# Altium schematic sheet top_ebox_v3.SchDoc
size A; SheetNumber: 1; SheetTotal: 2
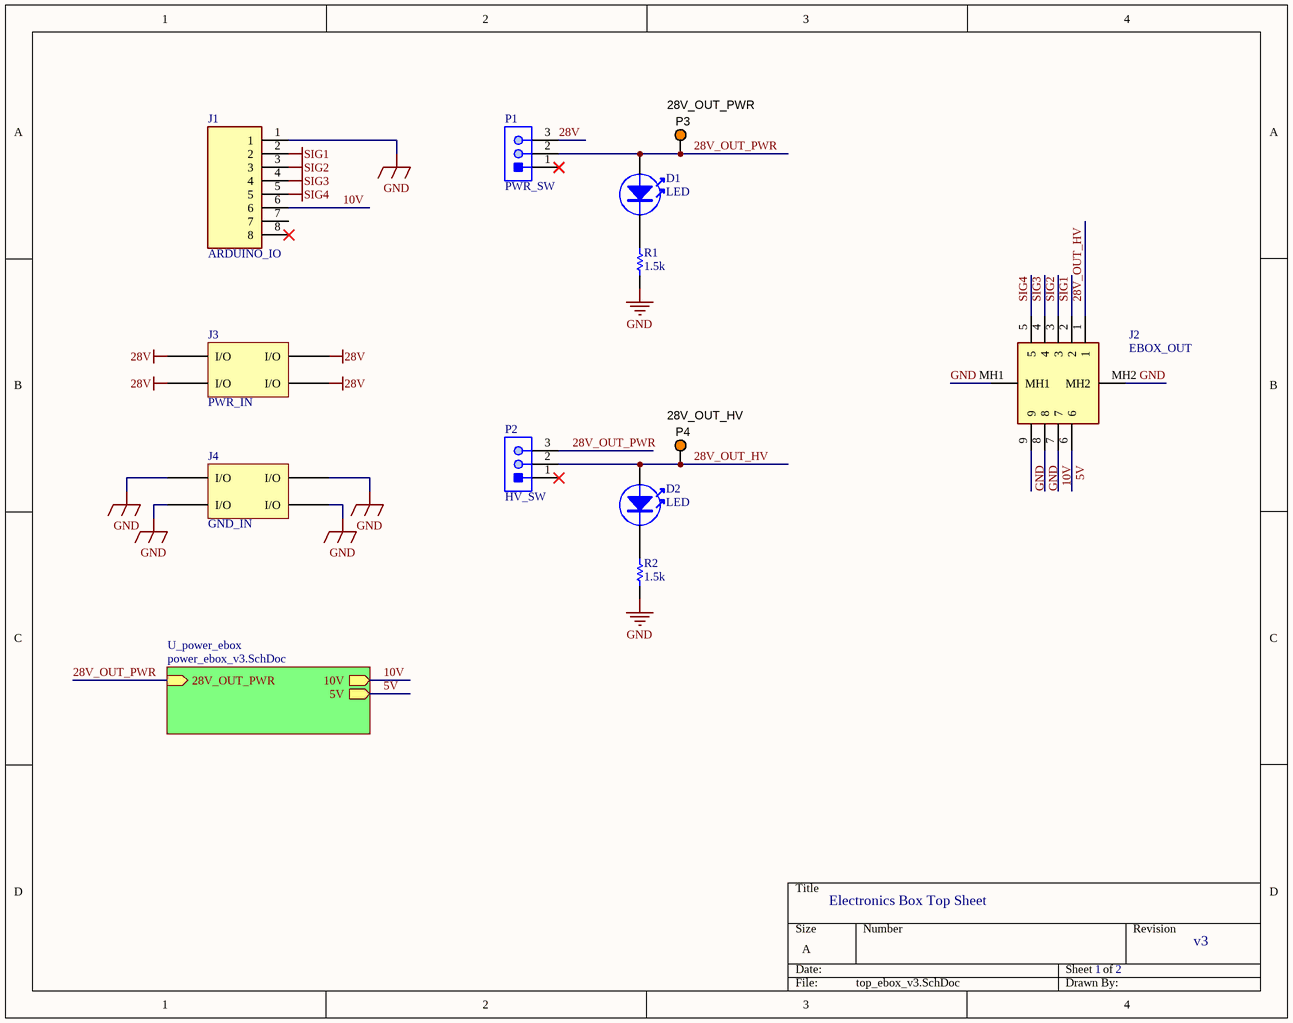
[diagram p0: top_ebox_v3.SchDoc]

## Parts
D1  LED  [LED 12V Thru Hole]
D2  LED  [LED 12V Thru Hole]
J1  ARDUINO_IO  [1x8 Molex Header - Female]
J2  EBOX_OUT  [9-Pin D-Sub]
J3  PWR_IN  [Banana Jack]
J4  GND_IN  [Banana Jack]
P1  PWR_SW  [3x1 KK Molex]
P2  HV_SW  [3x1 KK Molex]
P3  28V_OUT_PWR  [KSTN-5003]
P4  28V_OUT_HV  [KSTN-5003]
R1  1.5k  [General Resistor]
R2  1.5k  [General Resistor]

## Sub-sheets
U_power_ebox = power_ebox_v3.SchDoc: 10V (out), 5V (out), 28V_OUT_PWR (in)

## Nets
28V: J3.1(I/O) J3.2(I/O) J3.3(I/O) J3.4(I/O) P1.3
GND: J1.1 J2.8 J2.9 J2.MH1 J2.MH2 J4.1(I/O) J4.2(I/O) J4.3(I/O) J4.4(I/O) R1.2 R2.2
SIG1: J1.2 J2.2
SIG2: J1.3 J2.3
SIG3: J1.4 J2.4
SIG4: J1.5 J2.5
5V: J2.6 ; sheet U_power_ebox/5V
10V: J1.6 J2.7 ; sheet U_power_ebox/10V
28V_OUT_HV: D2.1 J2.1 P2.2 P4.1
28V_OUT_PWR: D1.1 P1.2 P2.3 P3.1 ; sheet U_power_ebox/28V_OUT_PWR
NetD1_2: D1.2 R1.1
NetD2_2: D2.2 R2.1

Not connected (* = marked no-connect by the designer): J1 7 8*; P1 1*; P2 1*

## Notes on the sheet
- Electronics Box Top Sheet
- 1
- 2
- v3

## Library data of the parts
J1 = 207843-0008: KK Molex 1x8 Header; Datasheet Link: https://www.molex.com/pdm_docs/sd/2078430008_sd.pdf; Height: 6.95mm; Manufacturer_Name: Molex; Manufacturer_Part_Number: 207843-0008; Mouser Part Number: 538-207843-0008; Mouser Price/Stock: https://www.mouser.co.uk/ProductDetail/Molex/207843-0008?qs=XeJtXLiO41QJV3n1oae5pg%3D%3D
J2 = 2311765-1: Connector; Manufacturer_Name: TE Connectivity; Datasheet Link: https://componentsearchengine.com//2311765-1.pdf; Height: 12.8mm; Mouser2 Part Number: 571-2311765-1; Mouser2 Price/Stock: https://www.mouser.com/Search/Refine.aspx?Keyword=571-2311765-1; Manufacturer_Part_Number: 2311765-1
J3 J4 = Banana Jack: Female
P1 P2 = KK 254 1x3 male header: 22112032
P3 P4 = CMP-002-00037-2: Test Point, Orange, Height 4.6 mm, Tail Length 3 mm, 1-Pin THD, RoHS; Manufacturer: Keystone; Colour: Orange; Packaging: Bulk; Package Description: 1-Pin Through Hole Device, Dia 2.54 mm; Pins: 1; Package Reference: 5003; Datasheet Version: Jun-15; Case/Package: 5003; Mounting Technology: TH; Connector Type: TestPoint; Diameter: 2.54mm; Contact Material: Bronze; Datasheet URL: http://keyelco.com/userAssets/file/M65p56.pdf; Manufacturer URL: http://www.keyelco.com/; Package Quantity: 10; Contact Plating: Tin; RoHS Compliant: True
R1 R2 = Resistor